# Altium schematic sheet Whitespace_Daughtercard_pwr.SchDoc: Daughtercard Power
size A3; DrawnBy: Ryan E. Guerra; Revision: 1.0; SheetNumber: 2; SheetTotal: 10
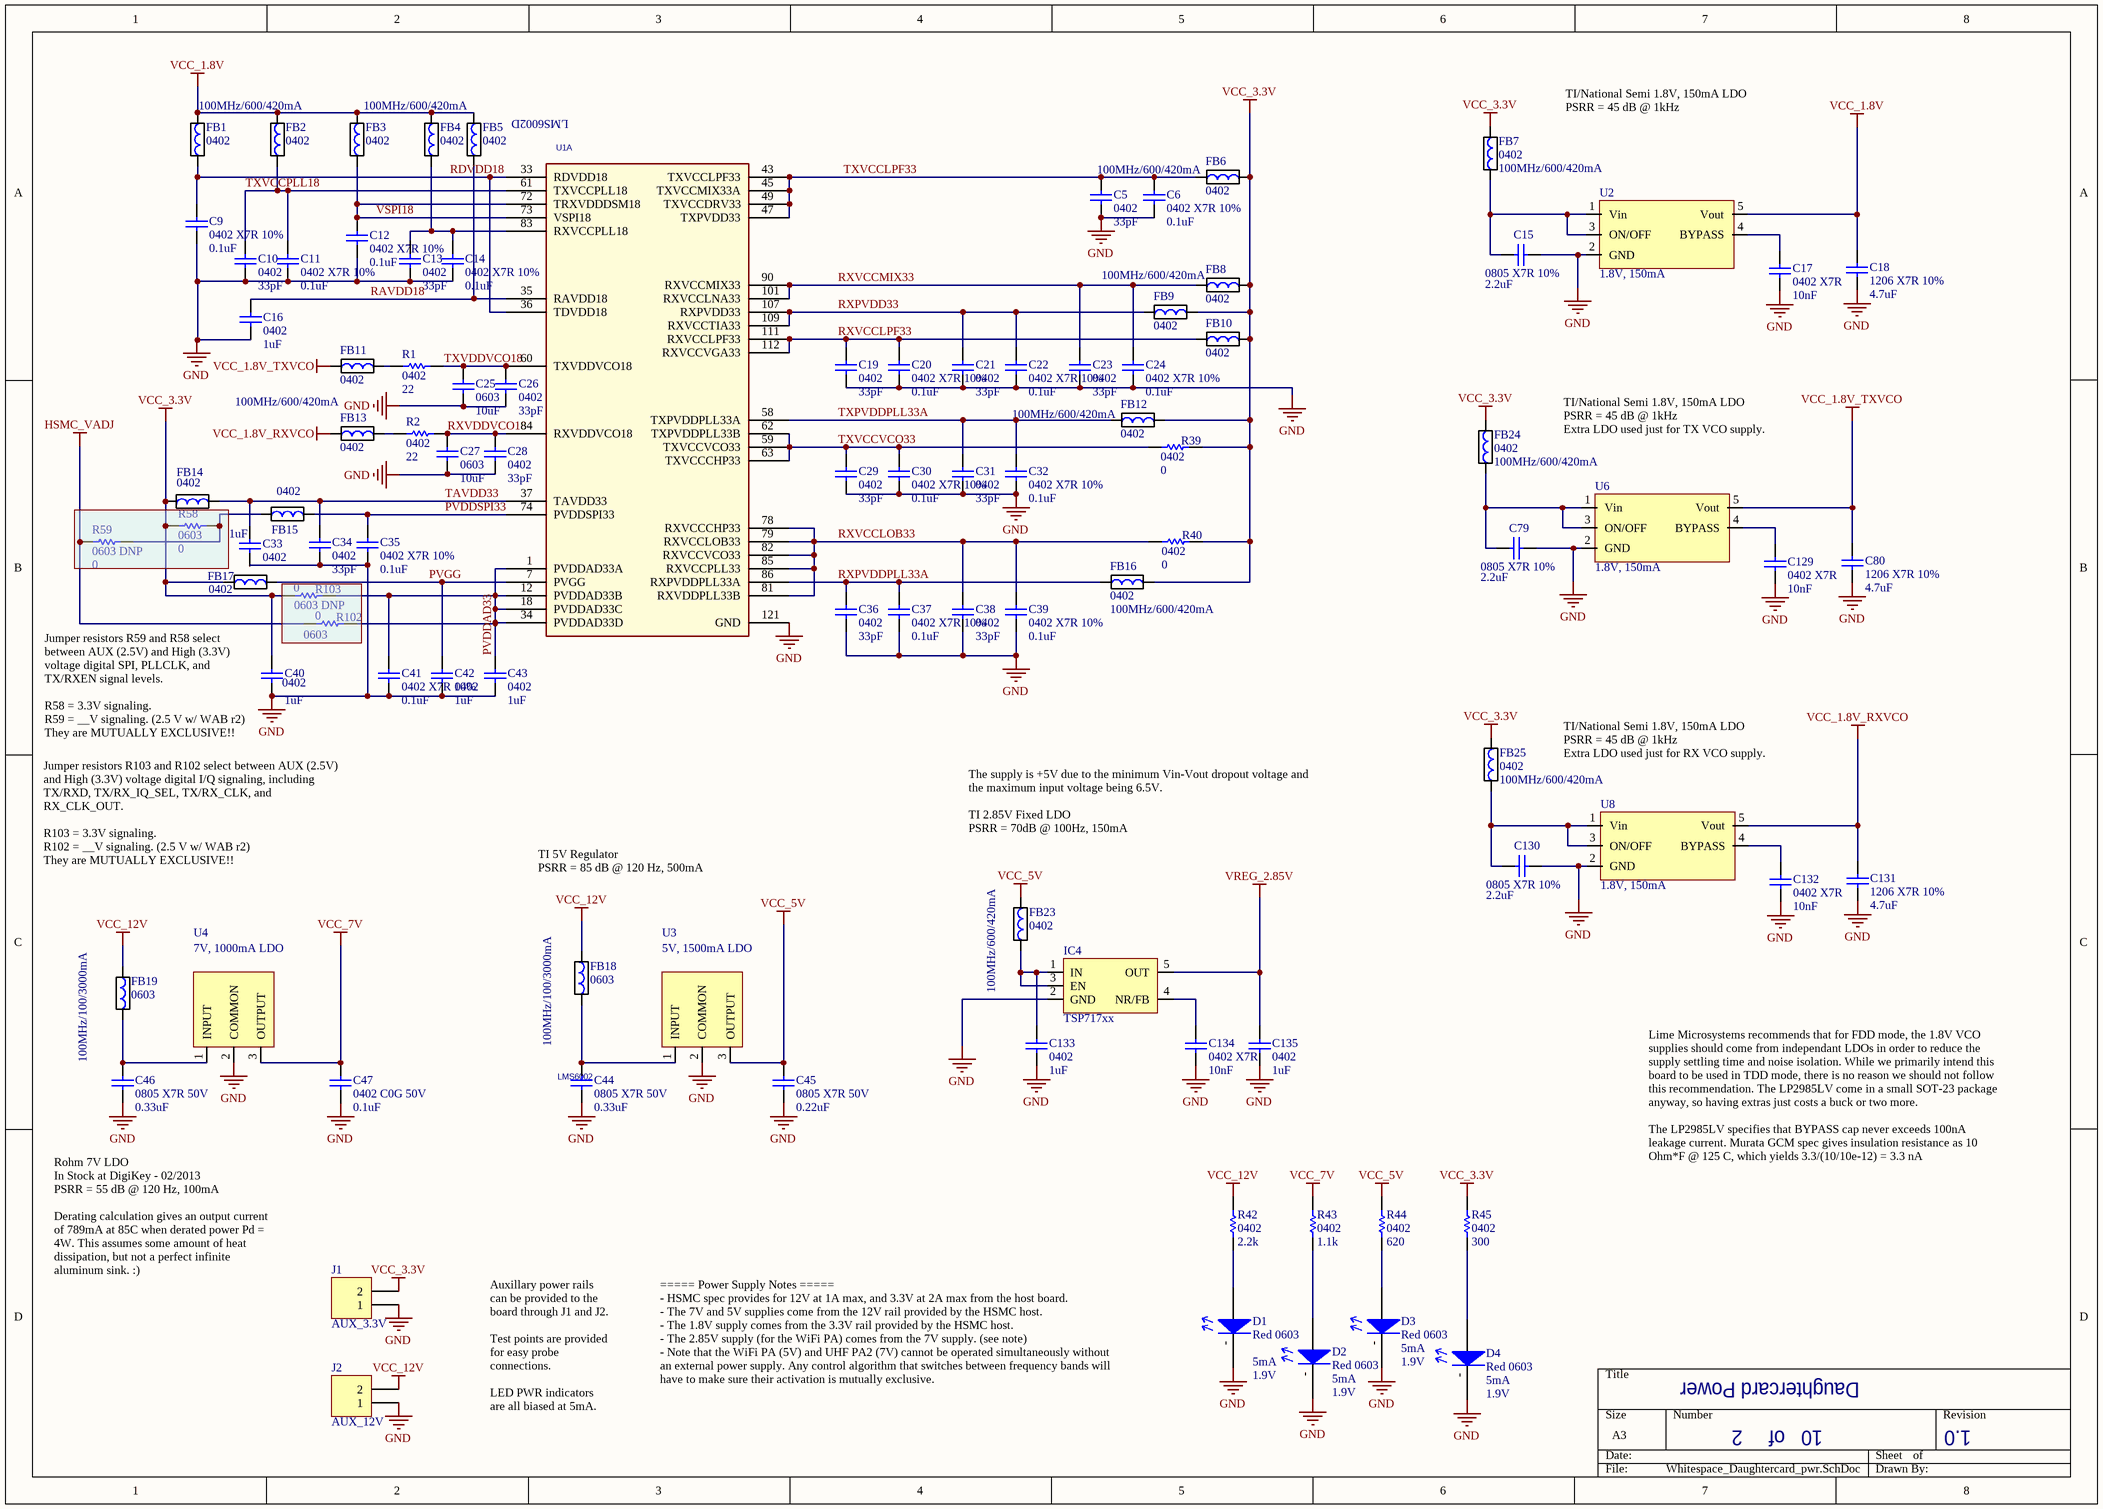
[diagram p0: Whitespace_Daughtercard_pwr.SchDoc]

## Parts
C5  0402  value 33pF  [0402_SMT_v3]
C6  0402 X7R 10%  value 0.1uF  [0402_SMT_v3]
C9  0402 X7R 10%  value 0.1uF  [0402_SMT_v3]
C10  0402  value 33pF  [0402_SMT_v3]
C11  0402 X7R 10%  value 0.1uF  [0402_SMT_v3]
C12  0402 X7R 10%  value 0.1uF  [0402_SMT_v3]
C13  0402  value 33pF  [0402_SMT_v3]
C14  0402 X7R 10%  value 0.1uF  [0402_SMT_v3]
C15  0805 X7R 10%  value 2.2uF  [0805_SMT_v3]
C16  0402  value 1uF  [0402_SMT_v3]
C17  0402 X7R  value 10nF  [0402_SMT_v3]
C18  1206 X7R 10%  value 4.7uF  [1206_SMT_v3]
C19  0402  value 33pF  [0402_SMT_v3]
C20  0402 X7R 10%  value 0.1uF  [0402_SMT_v3]
C21  0402  value 33pF  [0402_SMT_v3]
C22  0402 X7R 10%  value 0.1uF  [0402_SMT_v3]
C23  0402  value 33pF  [0402_SMT_v3]
C24  0402 X7R 10%  value 0.1uF  [0402_SMT_v3]
C25  0603  value 10uF  [0603_SMT_v3]
C26  0402  value 33pF  [0402_SMT_v3]
C27  0603  value 10uF  [0603_SMT_v3]
C28  0402  value 33pF  [0402_SMT_v3]
C29  0402  value 33pF  [0402_SMT_v3]
C30  0402 X7R 10%  value 0.1uF  [0402_SMT_v3]
C31  0402  value 33pF  [0402_SMT_v3]
C32  0402 X7R 10%  value 0.1uF  [0402_SMT_v3]
C33  0402  value 1uF  [0402_SMT_v3]
C34  0402  value 33pF  [0402_SMT_v3]
C35  0402 X7R 10%  value 0.1uF  [0402_SMT_v3]
C36  0402  value 33pF  [0402_SMT_v3]
C37  0402 X7R 10%  value 0.1uF  [0402_SMT_v3]
C38  0402  value 33pF  [0402_SMT_v3]
C39  0402 X7R 10%  value 0.1uF  [0402_SMT_v3]
C40  0402  value 1uF  [0402_SMT_v3]
C41  0402 X7R 10%  value 0.1uF  [0402_SMT_v3]
C42  0402  value 1uF  [0402_SMT_v3]
C43  0402  value 1uF  [0402_SMT_v3]
C44  0805 X7R 50V  value 0.33uF  [0805_SMT_v3]
C45  0805 X7R 50V  value 0.22uF  [0805_SMT_v3]
C46  0805 X7R 50V  value 0.33uF  [0805_SMT_v3]
C47  0402 C0G 50V  value 0.1uF  [0402_SMT_v3]
C79  0805 X7R 10%  value 2.2uF  [0805_SMT_v3]
C80  1206 X7R 10%  value 4.7uF  [1206_SMT_v3]
C129  0402 X7R  value 10nF  [0402_SMT_v3]
C130  0805 X7R 10%  value 2.2uF  [0805_SMT_v3]
C131  1206 X7R 10%  value 4.7uF  [1206_SMT_v3]
C132  0402 X7R  value 10nF  [0402_SMT_v3]
C133  0402  value 1uF  [0402_SMT_v3]
C134  0402 X7R  value 10nF  [0402_SMT_v3]
C135  0402  value 1uF  [0402_SMT_v3]
D1  Red 0603  Current: 5mA  Forward Voltage Drop: 1.9V  [0603_POLAR]
D2  Red 0603  Current: 5mA  Forward Voltage Drop: 1.9V  [0603_POLAR]
D3  Red 0603  Current: 5mA  Forward Voltage Drop: 1.9V  [0603_POLAR]
D4  Red 0603  Current: 5mA  Forward Voltage Drop: 1.9V  [0603_POLAR]
FB1  0402  value 100MHz/600/420mA  [0402_SMT_v3]
FB2  0402  [0402_SMT_v3]
FB3  0402  [0402_SMT_v3]
FB4  0402  [0402_SMT_v3]
FB5  0402  value 100MHz/600/420mA  [0402_SMT_v3]
FB6  0402  value 100MHz/600/420mA  [0402_SMT_v3]
FB7  0402  value 100MHz/600/420mA  [0402_SMT_v3]
FB8  0402  [0402_SMT_v3]
FB9  0402  value 100MHz/600/420mA  [0402_SMT_v3]
FB10  0402  [0402_SMT_v3]
FB11  0402  [0402_SMT_v3]
FB12  0402  value 100MHz/600/420mA  [0402_SMT_v3]
FB13  0402  value 100MHz/600/420mA  [0402_SMT_v3]
FB14  0402  [0402_SMT_v3]
FB15  0402  [0402_SMT_v3]
FB16  0402  value 100MHz/600/420mA  [0402_SMT_v3]
FB17  0402  [0402_SMT_v3]
FB18  0603  value 100MHz/100/3000mA  [0603_SMT_v3]
FB19  0603  value 100MHz/100/3000mA  [0603_SMT_v3]
FB23  0402  value 100MHz/600/420mA  [0402_SMT_v3]
FB24  0402  value 100MHz/600/420mA  [0402_SMT_v3]
FB25  0402  value 100MHz/600/420mA  [0402_SMT_v3]
IC4  TSP717xx  [SC70-5]
J1  AUX_3.3V  [HDR1X2]
J2  AUX_12V  [HDR1X2]
R1  0402  value 22  [0402_SMT_v3]
R2  0402  value 22  [0402_SMT_v3]
R39  0402  value 0  [0402_SMT_v3]
R40  0402  value 0  [0402_SMT_v3]
R42  0402  value 2.2k  [0402_SMT_v3]
R43  0402  value 1.1k  [0402_SMT_v3]
R44  0402  value 620  [0402_SMT_v3]
R45  0402  value 300  [0402_SMT_v3]
R58  0603  value 0  [0603_SMT_v3]
R59  0603 DNP  value 0  [0603_SMT_v3]
R102  0603  value 0  [0603_SMT_v3]
R103  0603 DNP  value 0  [0603_SMT_v3]
U1  LMS6002  [LMS6002D_VIAOFFPAD_v2_Window]  (part A of 4)
U2  1.8V, 150mA  [SOT-23_5Lead]
U3  5V, 1500mA LDO  [TO-263]
U4  7V, 1000mA LDO  [TO252-3]
U6  1.8V, 150mA  [SOT-23_5Lead]
U8  1.8V, 150mA  [SOT-23_5Lead]

## Nets
GND: C5.2 C6.1 C9.1 C10.1 C11.1 C12.1 C13.2 C14.1 C15.1 C16.2 C17.1 C18.1 C19.2 C20.1 C21.2 C22.1 C23.2 C24.1 C25.1 C26.2 C27.1 C28.2 C29.2 C30.1 C31.2 C32.1 C34.1 C35.2 C36.2 C37.1 C38.2 C39.1 C40.1 C41.1 C42.1 C43.1 C44.2 C45.2 C46.2 C47.1 C79.1 C80.1 C129.1 C130.1 C131.1 C132.1 C133.1 C134.1 C135.1 D1.-(Cathode) D2.-(Cathode) D3.-(Cathode) D4.-(Cathode) IC4.2(GND) J1.1 J2.1 U1.121(GND) U2.2(GND) U3.2(COMMON) U4.2(COMMON) U6.2(GND) U8.2(GND)
HSMC_VADJ: R59.1 R102.2
VCC_1.8V: C18.2 FB1.2 FB2.2 FB3.2 FB4.2 FB5.2 U2.5(Vout)
VCC_1.8V_RXVCO: C131.2 FB13.1 U8.5(Vout)
VCC_1.8V_TXVCO: C80.2 FB11.1 U6.5(Vout)
VCC_3.3V: C40.2 FB6.2 FB7.2 FB8.2 FB9.2 FB10.2 FB12.2 FB14.1 FB16.2 FB17.1 FB24.2 FB25.2 J1.2 R39.1 R40.1 R45.2 R58.1 R103.2
VCC_5V: C45.1 FB23.2 R44.2 U3.3(OUTPUT)
VCC_7V: C47.2 R43.2 U4.3(OUTPUT)
VCC_12V: FB18.1 FB19.1 J2.2 R42.2
VREG_2.85V: C135.2 IC4.5(OUT)
PVDDAD33: C41.2 C43.2 R102.1 R103.1 U1.1(PVDDAD33A) U1.12(PVDDAD33B) U1.18(PVDDAD33C) U1.34(PVDDAD33D)
PVDDSPI33: C35.1 FB15.2 U1.74(PVDDSPI33)
PVGG: C42.2 FB17.2 U1.7(PVGG)
RAVDD18: C16.1 FB5.1 U1.35(RAVDD18)
RDVDD18: C9.2 FB1.1 U1.33(RDVDD18) U1.36(TDVDD18)
RXPVDD33: C21.1 C22.2 FB9.1 U1.107(RXPVDD33) U1.109(RXVCCTIA33)
RXPVDDPLL33A: C36.1 C37.2 FB16.1 U1.86(RXPVDDPLL33A)
RXVCCLOB33: C38.1 C39.2 R40.2 U1.78(RXVCCCHP33) U1.79(RXVCCLOB33) U1.81(RXVDDPLL33B) U1.82(RXVCCVCO33) U1.85(RXVCCPLL33)
RXVCCLPF33: C19.1 C20.2 FB10.1 U1.111(RXVCCLPF33) U1.112(RXVCCVGA33)
RXVCCMIX33: C23.1 C24.2 FB8.1 U1.90(RXVCCMIX33) U1.101(RXVCCLNA33)
RXVDDVCO18: C27.2 C28.1 R2.1 U1.84(RXVDDVCO18)
TAVDD33: C33.2 C34.2 FB14.2 U1.37(TAVDD33)
TXPVDDPLL33A: C31.1 C32.2 FB12.1 U1.58(TXPVDDPLL33A)
TXVCCLPF33: C5.1 C6.2 FB6.1 U1.43(TXVCCLPF33) U1.45(TXVCCMIX33A) U1.47(TXPVDD33) U1.49(TXVCCDRV33)
TXVCCPLL18: C10.2 C11.2 FB2.1 U1.61(TXVCCPLL18)
TXVCCVCO33: C29.1 C30.2 R39.2 U1.59(TXVCCVCO33) U1.62(TXPVDDPLL33B) U1.63(TXVCCCHP33)
TXVDDVCO18: C25.2 C26.1 R1.1 U1.60(TXVDDVCO18)
VSPI18: C12.2 FB3.1 U1.72(TRXVDDDSM18) U1.73(VSPI18)
NetC13_1: C13.1 C14.2 FB4.1 U1.83(RXVCCPLL18)
NetC15_2: C15.2 FB7.1 U2.1(Vin) U2.3(ON/OFF)
NetC17_2: C17.2 U2.4(BYPASS)
NetC44_1: C44.1 FB18.2 U3.1(INPUT)
NetC46_1: C46.1 FB19.2 U4.1(INPUT)
NetC79_2: C79.2 FB24.1 U6.1(Vin) U6.3(ON/OFF)
NetC129_2: C129.2 U6.4(BYPASS)
NetC130_2: C130.2 FB25.1 U8.1(Vin) U8.3(ON/OFF)
NetC132_2: C132.2 U8.4(BYPASS)
NetC133_2: C133.2 FB23.1 IC4.1(IN) IC4.3(EN)
NetC134_2: C134.2 IC4.4(NR/FB)
NetD1_+: D1.+(Anode) R42.1
NetD2_+: D2.+(Anode) R43.1
NetD3_+: D3.+(Anode) R44.1
NetD4_+: D4.+(Anode) R45.1
NetFB11_2: FB11.2 R1.2
NetFB13_2: FB13.2 R2.2
NetFB15_1: FB15.1 R58.2 R59.2

Not connected (* = marked no-connect by the designer): C33 1

## Notes on the sheet
- TI/National Semi 1.8V, 150mA LDO
  PSRR = 45 dB @ 1kHz
- TI/National Semi 1.8V, 150mA LDO
  PSRR = 45 dB @ 1kHz
  Extra LDO used just for TX VCO supply.
- (near C40) Jumper resistors R59 and R58 select between AUX (2.5V) and High (3.3V) voltage digital SPI, PLLCLK, and TX/RXEN signal levels.
  R58 = 3.3V signaling.
  R59 = __V signaling. (2.5 V w/ WAB r2)
  They are MUTUALLY EXCLUSIVE!!
- TI/National Semi 1.8V, 150mA LDO
  PSRR = 45 dB @ 1kHz
  Extra LDO used just for RX VCO supply.
- (near FB23) The supply is +5V due to the minimum Vin-Vout dropout voltage and the maximum input voltage being 6.5V.
  TI 2.85V Fixed LDO
  PSRR = 70dB @ 100Hz, 150mA
- Jumper resistors R103 and R102 select between AUX (2.5V) and High (3.3V) voltage digital I/Q signaling, including TX/RXD, TX/RX_IQ_SEL, TX/RX_CLK, and RX_CLK_OUT.
  R103 = 3.3V signaling.
  R102 = __V signaling. (2.5 V w/ WAB r2)
  They are MUTUALLY EXCLUSIVE!!
- TI 5V Regulator
  PSRR = 85 dB @ 120 Hz, 500mA
- Lime Microsystems recommends that for FDD mode, the 1.8V VCO supplies should come from independant LDOs in order to reduce the supply settling time and noise isolation. While we primarily intend this board to be used in TDD mode, there is no reason we should not follow this recommendation. The LP2985LV come in a small SOT-23 package anyway, so having extras just costs a buck or two more.
  The LP2985LV specifies that BYPASS cap never exceeds 100nA leakage current. Murata GCM spec gives insulation resistance as 10 Ohm*F @ 125 C, which yields 3.3/(10/10e-12) = 3.3 nA
- Rohm 7V LDO
  In Stock at DigiKey - 02/2013
  PSRR = 55 dB @ 120 Hz, 100mA
  Derating calculation gives an output current of 789mA at 85C when derated power Pd = 4W. This assumes some amount of heat dissipation, but not a perfect infinite aluminum sink. :)
- Auxillary power rails can be provided to the board through J1 and J2.
  Test points are provided for easy probe connections.
  LED PWR indicators are all biased at 5mA.
- of
- (in symbol LMS6002, part A) LMS6002D

## Library data of the parts
C5 C6 C9-C47 C79 C80 C129-C135 = Cap Semi: Capacitor (Semiconductor SIM Model); Published: 8-Jun-2000; LatestRevisionDate: 29-May-2009; LatestRevisionNote: IPC-7351 Footprint Added.; PackageReference: C1206; Publisher: Altium Limited; PackageDescription: Chip Capacitor
  C5 C10 C13 C19 C21 C23 C26 C28 C29 C31 C34 C36 C38: Supplier 1: Mouser; Supplier Part Number 1: 81-GRM1555C1H330JA1D
  C6 C9 C11 C12 C14 C20 C22 C24 C30 C32 C35 C37 C39 C41: Supplier 1: Mouser; Supplier Part Number 1: 810-C1005X7R1H104K
  C15 C79 C130: Supplier 1: Mouser; Supplier Part Number 1: 963-UMK212BB7225KG-T
  C16 C33 C40 C42 C43 C133 C135: Supplier 1: Mouser; Supplier Part Number 1: 810-C1005X5R1E105K
  C17 C129 C132 C134: Supplier 1: Mouser; Supplier Part Number 1: 81-GCM155R71H103KA5D
  C18 C80 C131: Supplier 1: Mouser; Supplier Part Number 1: 963-UMK316AB7475KL-T
  C25 C27: Supplier 1: Mouser; Supplier Part Number 1: 963-EMK107BBJ106MA-T
  C44 C46: Supplier 1: Mouser; Supplier Part Number 1: 81-GRM219R71H334KA88
  C45: Supplier 1: Mouser; Supplier Part Number 1: 81-GRM40X7R224K050AL
  C47: Supplier 1: TDK; Supplier Part Number 1: 810-C1005X7R1H104K
D1-D4 = LED: Supplier 1: Mouser; Supplier Part Number 1: 859-LTSTC193KRKT5A
FB1 FB5-FB7 FB9 FB12 FB13 FB16 FB18 FB19 FB23-FB25 = FERRITE_BEAD: Ferrite Bead, Various Values; Supplier 1: Mouser
  FB1 FB5-FB7 FB9 FB12 FB13 FB16 FB23-FB25: Supplier Part Number 1: 81-BLM15AX601SN1D
  FB18 FB19: Pricing: 1=0.340, 50=0.120, 100=0.066, 500=0.047, 1000=0.035, 4000=0.025, 8000=0.023, 12000=0.022, 20000=0.019 (USD); Supplier Part Number 1: 81-BLM18KG101TN1D
FB2-FB4 FB8 FB10 FB11 FB14 FB15 FB17 = FERRITE_BEAD: Ferrite Bead, Various Values; Value: 100MHz/600/420mA; Supplier 1: Mouser; Supplier Part Number 1: 81-BLM15AX601SN1D
IC4 = TSP717xx: TI LDO Regulator SC70-5 0.9-6.2V; Supplier 1: Mouser; Supplier Part Number 1: 595-TPS717285DCKR
J1 J2 = Header 2: Header, 2-Pin; LatestRevisionDate: 17-Jul-2002; LatestRevisionNote: Re-released for DXP Platform.; Publisher: Altium Limited
R1 R2 R39 R40 R42-R45 R58 R59 R102 R103 = Res Semi: Semiconductor Resistor; Published: 8-Jun-2000; LatestRevisionDate: 17-Jul-2002; LatestRevisionNote: Re-released for DXP Platform.; PackageReference: AXIAL-0.5; Publisher: Altium Limited; PackageDescription: Axial Device, Thru-Hole; 2 Leads; 0.5 in Pin Spacing; Supplier 1: Mouser
  R1 R2: Supplier Part Number 1: 667-ERJ-2GEJ220X
  R39 R40: Supplier Part Number 1: 660-RK73Z1ETTP
  R42: Supplier Part Number 1: 660-RK73B1ETTP222J
  R43: Supplier Part Number 1: 660-RK73B1ETTP112J
  R44: Supplier Part Number 1: 660-RK73B1ETTP621J
  R45: Supplier Part Number 1: 660-RK73B1ETTP301J
  R58 R59 R102 R103: Supplier Part Number 1: 660-RK73Z1JTTDD
U1 = LMS6002: Lime Microsystems Wideband Transceiver Module
U2 U6 U8 = LP2985IM5-1.8: TO LDO 1.8V 150mA Regulator w/ ON/OFF; Supplier 1: Mouser; Supplier Part Number 1: 926-2985IM5-1.8/NOPB
U3 = TL780-05CKTTRG3: TI 5V, 1500mA LDO; Supplier 1: Mouser; Supplier Part Number 1: 595-TL780-05CKTTR
U4 = BA7807FP: ROHM 7V, 1000mA LDO; Supplier 1: Digi-Key; Supplier Part Number 1: BA7807FP-E2DKR-ND